# Altium project PoE_Base.PrjPcb
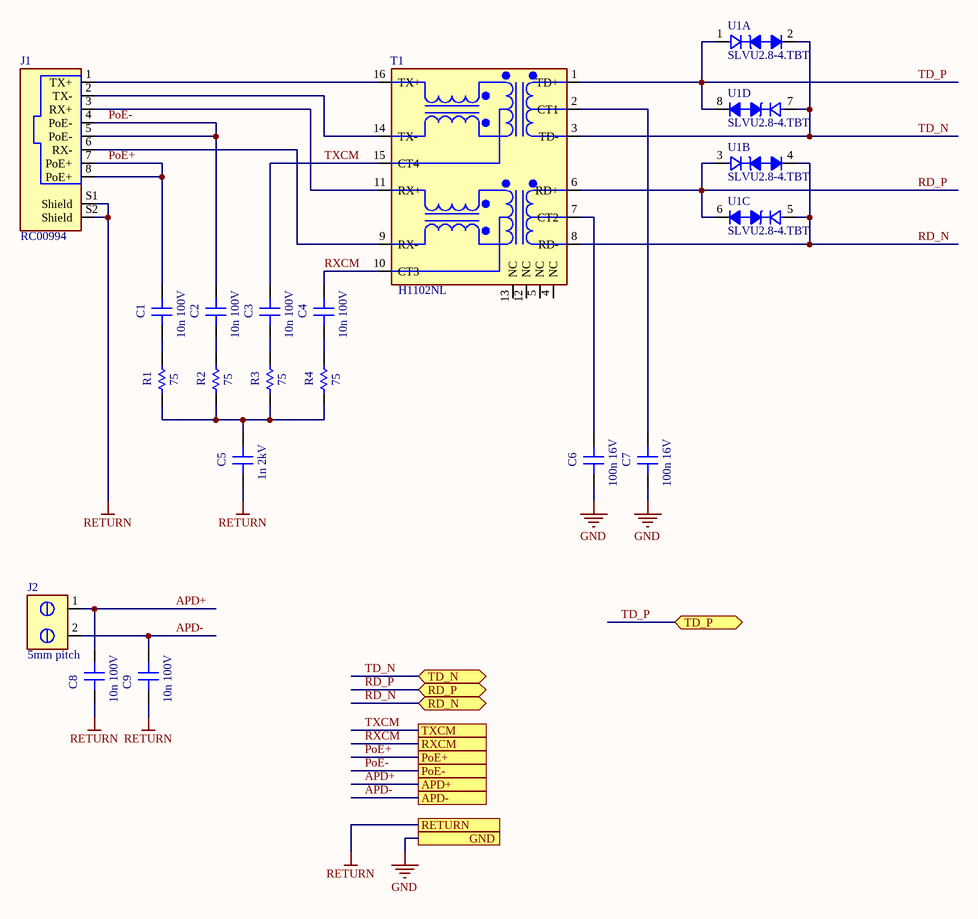
[diagram p0: Sch_Input.SchDoc]
documentnumber: 1; Engineer1: Renan Duarte; Engineer2: André P.; Engineer3: Guilherme B.; Engineer4: Rafael B.; revision: 0; title: PoE Base Board
5 sheets, 106 parts. Net scope: flat (ports and power ports of the same name join across sheets).
Board file: PCB_Base.PcbDoc
Sheets:
  Sch_Input.SchDoc
  Sch_Power.SchDoc
  Sch_Phy.SchDoc
  Sch_Buck.SchDoc
  Sch_Control.SchDoc

## Sheet Sch_Input.SchDoc: PoE Base Board
size A4; ENG_APP_DATE: --/--/--; DSN_APP_DATE: --/--/--; CHK_APP_DATE: --/--/--; CompanyName: Universidade Federal de Santa Maria; Organization: Universidade Federal de Santa Maria; Address1: Av. Roraima 1000; Address2: Camobi; Address3: Santa Maria - RS; Address4: Brasil; SheetNumber: 2; SheetTotal: 6

### Parts
(Parts that share a designator on the sheet are numbered #1, #2 ... from top to bottom, then left to right.)
C1#1  10n 100V  [CAP_SMD_0603]
C2#1  10n 100V  [CAP_SMD_0603]
C3#1  10n 100V  [CAP_SMD_0603]
C4#1  10n 100V  [CAP_SMD_0603]
C5#1  1n 2kV  [CAP_SMD_1206]
C6  100n 16V  [CAP_SMD_0603]
C7  100n 16V  [CAP_SMD_0603]
C8  10n 100V  [CAP_SMD_0603]
C9  10n 100V  [CAP_SMD_0603]
J1#1  RC00994  [CON_PTH_RJ45_RC00994]
J2  5mm pitch  [CON_SCREW_5mm]
R1#1  75  [RES_SMD_0603]
R2  75  [RES_SMD_0603]
R3  75  [RES_SMD_0603]
R4  75  [RES_SMD_0603]
T1  H1102NL  [T_SMD_H1102NL]
U1#1  SLVU2.8-4.TBT  [IC_SOIC8]  (parts A,B,C,D of 4)

### Ports
APD+, APD-, GND, PoE+, PoE-, RD_N (bidir), RD_P (bidir), RETURN, RXCM, TD_N (bidir), TD_P (bidir), TXCM

### Nets
APD-: C6.2 C7.2 C9.1 J2.2 ; port APD-, port GND  [also labelled GND]
RETURN: C5#1.2 C8.2 C9.2 J1#1.S1(Shield) J1#1.S2(Shield) ; port RETURN
APD+: C8.1 J2.1 ; port APD+
PoE+: C1#1.1 J1#1.7(PoE+) J1#1.8(PoE+) ; port PoE+
PoE-: C2#1.1 J1#1.4(PoE-) J1#1.5(PoE-) ; port PoE-
RD_N: T1.8(RD-) U1#1.4 U1#1.5 ; port RD_N
RD_P: T1.6(RD+) U1#1.3 U1#1.6 ; port RD_P
RXCM: C4#1.1 T1.10(CT3) ; port RXCM
TD_N: T1.3(TD-) U1#1.2 U1#1.7 ; port TD_N
TD_P: T1.1(TD+) U1#1.1 U1#1.8 ; port TD_P
TXCM: C3#1.1 T1.15(CT4) ; port TXCM
NetC1#1_2: C1#1.2 R1#1.1
NetC2#1_2: C2#1.2 R2.1
NetC3#1_2: C3#1.2 R3.1
NetC4#1_2: C4#1.2 R4.1
NetC5#1_1: C5#1.1 R1#1.2 R2.2 R3.2 R4.2
NetC6_1: C6.1 T1.7(CT2)
NetC7_1: C7.1 T1.2(CT1)
NetJ1#1_1: J1#1.1(TX+) T1.16(TX+)
NetJ1#1_2: J1#1.2(TX-) T1.14(TX-)
NetJ1#1_3: J1#1.3(RX+) T1.11(RX+)
NetJ1#1_6: J1#1.6(RX-) T1.9(RX-)

Not connected (* = marked no-connect by the designer): T1 4(NC) 5(NC) 12(NC) 13(NC)

### Notes on the sheet
- Engineers
- Title
- Size:
- Date:
- A4
- Number:
- Time:
- Revision:
- Sheet
- of
- File:

### Library data of the parts
C1#1 C2#1 C3#1 C4#1 C5#1 C6-C9 = CAP_SMD: Capacitor SMD - Generic
J1#1 = CON_PTH_RJ45_RC00994: RC00994 RJ45 connector - No LEDs
J2 = CON_SCREW-2P-5mm: 5mm pitch 2P screw terminal block
R1#1 R2-R4 = RES_SMD: Resistor SMD - Generic
T1 = H1102NL: Isolation and Data Interface (Encapsulated) Pulse Transformer 1:1 Transmitter, 1:1 Receiver Surface Mount; SnapEDA_Link: https://www.snapeda.com/parts/H1102NL/Pulse/view-part/?ref=snap; Package: Non Standard Pulse; Value: *; MF: Pulse; MP: H1102NL; Check_prices: https://www.snapeda.com/parts/H1102NL/Pulse/view-part/?ref=eda
U1#1 = IC_SLVU2.8-4.TBT: 15V Clamp 24A (8/20µs) Ipp Tvs Diode Surface Mount 8-SO; MF: Semtech Corporation; SnapEDA_Link: https://www.snapeda.com/parts/SLVU2.8-4.TBT/Semtech/view-part/?ref=snap; Package: SOIC-8 Semtech; Value: *; MP: SLVU2.8-4.TBT; Check_prices: https://www.snapeda.com/parts/SLVU2.8-4.TBT/Semtech/view-part/?ref=eda

## Sheet Sch_Power.SchDoc: PoE Base Board
size A4; ENG_APP_DATE: --/--/--; DSN_APP_DATE: --/--/--; CHK_APP_DATE: --/--/--; CompanyName: Universidade Federal de Santa Maria; Organization: Universidade Federal de Santa Maria; Address1: Av. Roraima 1000; Address2: Camobi; Address3: Santa Maria - RS; Address4: Brasil; SheetNumber: 3; SheetTotal: 6
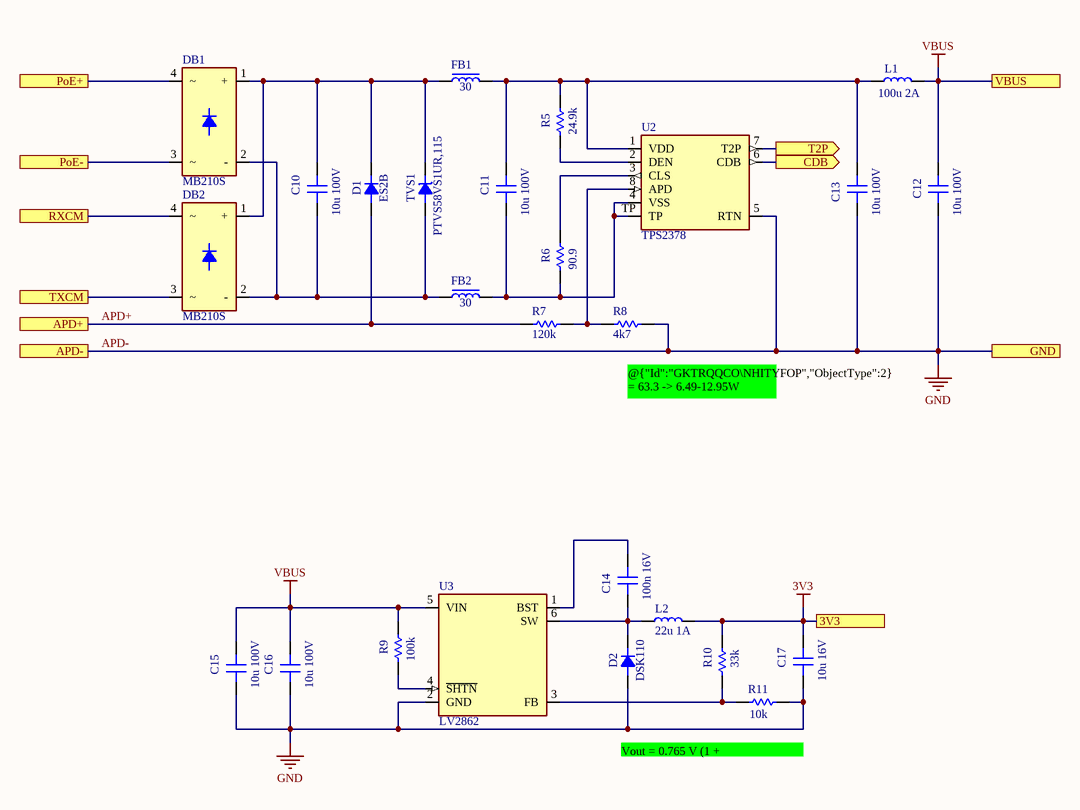
[diagram p1: Sch_Power.SchDoc]

### Parts
C10  10u 100V  [CAP_SMD_1210]
C11  10u 100V  [CAP_SMD_1210]
C12  10u 100V  [CAP_SMD_1210]
C13  10u 100V  [CAP_SMD_1210]
C14  100n 16V  [CAP_SMD_0603]
C15  10u 100V  [CAP_SMD_1210]
C16  10u 100V  [CAP_SMD_1210]
C17  10u 16V  [CAP_SMD_1210]
D1  ES2B  [D_SMA]
D2  DSK110  [D_SMD_SOD123W]
DB1  MB210S  [IC_MBS]
DB2  MB210S  [IC_MBS]
FB1  30  [FB_SMD_0805]
FB2  30  [FB_SMD_0805]
L1  100u 2A  [IND_SMD7.1x6.6x5]
L2  22u 1A  [IND_SMD3x3x1.2mm]
R5  24.9k  [RES_SMD_0603]
R6  90.9  [RES_SMD_0603]
R7  120k  [RES_SMD_0603]
R8  4k7  [RES_SMD_0603]
R9  100k  [RES_SMD_0603]
R10  33k  [RES_SMD_0603]
R11  10k  [RES_SMD_0603]
TVS1  PTVS58VS1UR,115  [D_SOD123W]
U2  TPS2378  [IC_SOIC8_TP]
U3  LV2862  [IC_SOT23_6]

### Ports
3V3, APD+, APD-, CDB (out), GND, PoE+, PoE-, RXCM, T2P (out), TXCM, VBUS

### Nets
3V3: C17.1 L2.2 R10.1 ; port 3V3
APD-: C12.2 C13.2 C15.2 C16.2 C17.2 D2.A R8.2 R11.2 U2.5(RTN) U3.2(GND) ; port APD-, port GND  [also labelled GND]
VBUS: C12.1 C15.1 C16.1 L1.2 R9.1 U3.5(VIN) ; port VBUS
APD+: D1.A R7.1 ; port APD+
CDB: U2.6(CDB) ; port CDB
PoE+: DB1.4 ; port PoE+
PoE-: DB1.3 ; port PoE-
RXCM: DB2.4 ; port RXCM
T2P: U2.7(T2P) ; port T2P
TXCM: DB2.3 ; port TXCM
NetC10_1: C10.1 D1.K DB1.1(+) DB2.1(+) FB1.1 TVS1.K
NetC10_2: C10.2 DB1.2(-) DB2.2(-) FB2.1 TVS1.A
NetC11_1: C11.1 C13.1 FB1.2 L1.1 R5.1 U2.1(VDD)
NetC11_2: C11.2 FB2.2 R6.2 U2.4(VSS) U2.TP
NetC14_1: C14.1 U3.1(BST)
NetC14_2: C14.2 D2.K L2.1 U3.6(SW)
NetR5_2: R5.2 U2.2(DEN)
NetR6_1: R6.1 U2.3(CLS)
NetR7_2: R7.2 R8.1 U2.8(APD)
NetR9_2: R9.2 U3.4(~{SHTN})
NetR10_2: R10.2 R11.1 U3.3(FB)

### Notes on the sheet
- (near R8) @{"Id":"GKTRQQCO\NHITYFOP","ObjectType":2} = 63.3 -> 6.49-12.95W
  @{"Id":"GKTRQQCO\NHITYFOP","ObjectType":2} = 90.9 -> 12.95-25.5W
- (near R11) Vout = 0.765 V (1 + (@{"Id":"GKTRQQCO\DMOJSVDS","ObjectType":2} / @{"Id":"GKTRQQCO\RENRJCZA","ObjectType":2}))
- Engineers
- Title
- Size:
- Date:
- A4
- Number:
- Time:
- Revision:
- Sheet
- of
- File:

### Library data of the parts
C10-C17 = CAP_SMD: Capacitor SMD - Generic
D1 = ES1J: 100V 2A Super Fast Recovery Rectifier; Datasheet: https://www.onsemi.com/download/data-sheet/pdf/es1j-d.pdf
D2 = DIODE_SMD: 100V 1A Schottky Barrier Diode
DB1 DB2 = MB2S: 100 2A diode bridge; MF: Fortune Semiconductor; MP: DW01A; SnapEDA_Link: https://www.snapeda.com/parts/DW01A/Fortune+Semiconductor/view-part/?ref=snap; Package: SOT-23-6 Fortune Semiconductor; Value: *; Check_prices: https://www.snapeda.com/parts/DW01A/Fortune+Semiconductor/view-part/?ref=eda
FB1 FB2 = FB_SMD: Ferrite bead SMD - Generic
L1 L2 = IND_SMD: Inductor SMD - Generic
R5-R11 = RES_SMD: Resistor SMD - Generic
TVS1 = ZENER_SMD: SMD zener diode - Generic
U2 = TPS2378: IEEE 802.3at PoE High-Power PD Interface; MF: Fortune Semiconductor; MP: DW01A; SnapEDA_Link: https://www.snapeda.com/parts/DW01A/Fortune+Semiconductor/view-part/?ref=snap; Package: SOT-23-6 Fortune Semiconductor; Value: *; Check_prices: https://www.snapeda.com/parts/DW01A/Fortune+Semiconductor/view-part/?ref=eda
U3 = LV2862: Buck converter controller; Datasheet: https://www.littelfuse.com/assetdocs/littelfuse-integrated-circuits-mxhv9910-datasheet?assetguid=0135616d-093f-45d8-8766-b0e533f2ef99

## Sheet Sch_Phy.SchDoc: PoE Base Board
size A4; ENG_APP_DATE: --/--/--; DSN_APP_DATE: --/--/--; CHK_APP_DATE: --/--/--; CompanyName: Universidade Federal de Santa Maria; Organization: Universidade Federal de Santa Maria; Address1: Av. Roraima 1000; Address2: Camobi; Address3: Santa Maria - RS; Address4: Brasil; SheetNumber: 4; SheetTotal: 6
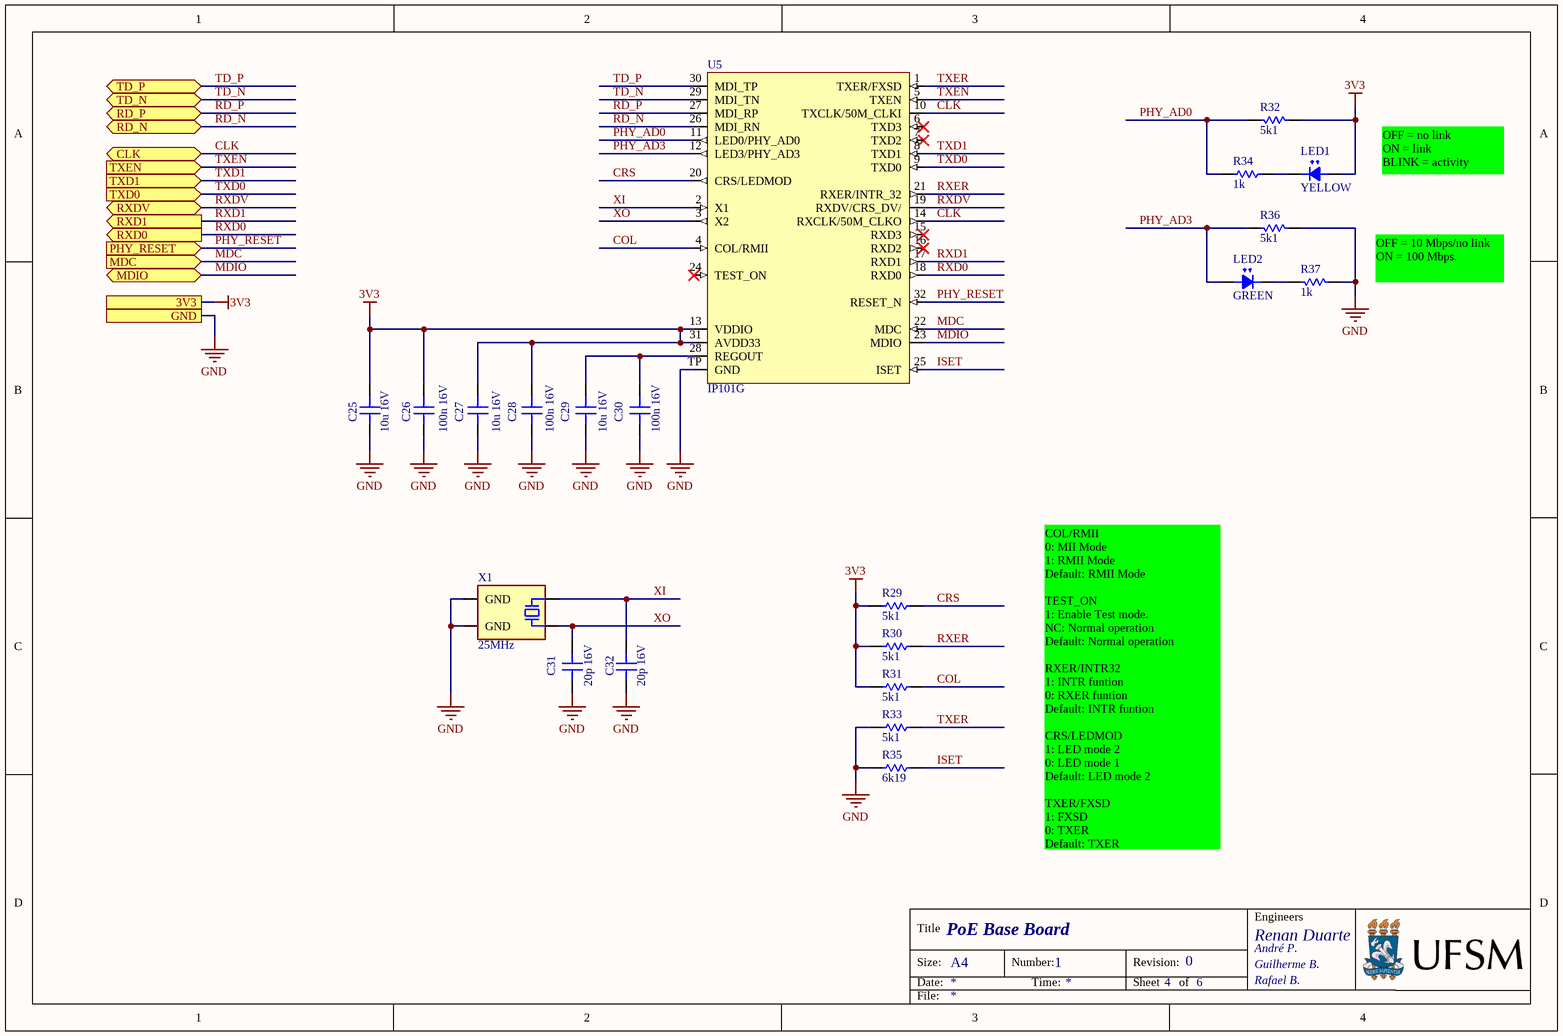
[diagram p2: Sch_Phy.SchDoc]

### Parts
C25  10u 16V  [CAP_SMD_0603]
C26  100n 16V  [CAP_SMD_0603]
C27  10u 16V  [CAP_SMD_0603]
C28  100n 16V  [CAP_SMD_0603]
C29  10u 16V  [CAP_SMD_0603]
C30  100n 16V  [CAP_SMD_0603]
C31  20p 16V  [CAP_SMD_0603]
C32  20p 16V  [CAP_SMD_0603]
LED1  YELLOW  [LED_SMD_0603]
LED2  GREEN  [LED_SMD_0603]
R29  5k1  [RES_SMD_0603]
R30  5k1  [RES_SMD_0603]
R31  5k1  [RES_SMD_0603]
R32  5k1  [RES_SMD_0603]
R33  5k1  [RES_SMD_0603]
R34  1k  [RES_SMD_0603]
R35  6k19  [RES_SMD_0603]
R36  5k1  [RES_SMD_0603]
R37  1k  [RES_SMD_0603]
U5  IP101G  [IC_QFN32_4x4]
X1  25MHz  [XTAL_SMD_3525]

### Ports
3V3, CLK (bidir), GND, MDC (in), MDIO (bidir), PHY_RESET (in), RD_N (bidir), RD_P (bidir), RXD0 (out), RXD1 (out), RXDV (bidir), TD_N (bidir), TD_P (bidir), TXD0 (in), TXD1 (in), TXEN (in)

### Nets
3V3: C25.1 C26.1 C27.1 C28.1 LED1.A R29.2 R30.2 R31.2 R32.2 U5.13(VDDIO) U5.31(AVDD33) ; port 3V3
GND: C25.2 C26.2 C27.2 C28.2 C29.2 C30.2 C31.2 C32.2 R33.2 R35.2 R36.2 R37.2 U5.TP(GND) X1.2(GND) X1.4(GND) ; port GND  [project net APD-]
CLK: U5.10(TXCLK/50M_CLKI) U5.14(RXCLK/50M_CLKO) ; port CLK
COL: R31.1 U5.4(COL/RMII)
CRS: R29.1 U5.20(CRS/LEDMOD)
ISET: R35.1 U5.25(ISET)
MDC: U5.22(MDC) ; port MDC
MDIO: U5.23(MDIO) ; port MDIO
PHY_AD0: R32.1 R34.2 U5.11(LED0/PHY_AD0)
PHY_AD3: LED2.A R36.1 U5.12(LED3/PHY_AD3)
PHY_RESET: U5.32(RESET_N) ; port PHY_RESET
RD_N: U5.26(MDI_RN) ; port RD_N
RD_P: U5.27(MDI_RP) ; port RD_P
RXD0: U5.18(RXD0) ; port RXD0
RXD1: U5.17(RXD1) ; port RXD1
RXDV: U5.19(RXDV/CRS_DV/) ; port RXDV
RXER: R30.1 U5.21(RXER/INTR_32)
TD_N: U5.29(MDI_TN) ; port TD_N
TD_P: U5.30(MDI_TP) ; port TD_P
TXD0: U5.9(TXD0) ; port TXD0
TXD1: U5.8(TXD1) ; port TXD1
TXEN: U5.5(TXEN) ; port TXEN
TXER: R33.1 U5.1(TXER/FXSD)
XI: C32.1 U5.2(X1) X1.3
XO: C31.1 U5.3(X2) X1.1
NetC29_1: C29.1 C30.1 U5.28(REGOUT)
NetLED1_K: LED1.K R34.1
NetLED2_K: LED2.K R37.1

Not connected (* = marked no-connect by the designer): U5 6(TXD3)* 7(TXD2)* 15(RXD3)* 16(RXD2)* 24(TEST_ON)*

### Notes on the sheet
- OFF = no link
  ON = link
  BLINK = activity
- (near R37) OFF = 10 Mbps/no link
  ON = 100 Mbps.
- COL/RMII
  0: MII Mode
  1: RMII Mode
  Default: RMII Mode
  TEST_ON
  1: Enable Test mode.
  NC: Normal operation
  Default: Normal operation
  RXER/INTR32
  1: INTR funtion
  0: RXER funtion
  Default: INTR funtion
  CRS/LEDMOD
  1: LED mode 2
  0: LED mode 1
  Default: LED mode 2
  TXER/FXSD
  1: FXSD
  0: TXER
  Default: TXER
- Engineers
- Title
- Size:
- Date:
- A4
- Number:
- Time:
- Revision:
- Sheet
- of
- File:

### Library data of the parts
C25-C32 = CAP_SMD: Capacitor SMD - Generic
LED1 LED2 = LED_SMD: LED SMD - Generic
R29-R37 = RES_SMD: Resistor SMD - Generic
U5 = IC_IP101G: Single Port 10/100 MII/RMII/TP/Fiber Fast Ethernet Transceiver
X1 = XTAL_SMD_GND: SMD Crystal with GND - Generic

## Sheet Sch_Buck.SchDoc: PoE Base Board
size A4; ENG_APP_DATE: --/--/--; DSN_APP_DATE: --/--/--; CHK_APP_DATE: --/--/--; CompanyName: Universidade Federal de Santa Maria; Organization: Universidade Federal de Santa Maria; Address1: Av. Roraima 1000; Address2: Camobi; Address3: Santa Maria - RS; Address4: Brasil; SheetNumber: 5; SheetTotal: 6
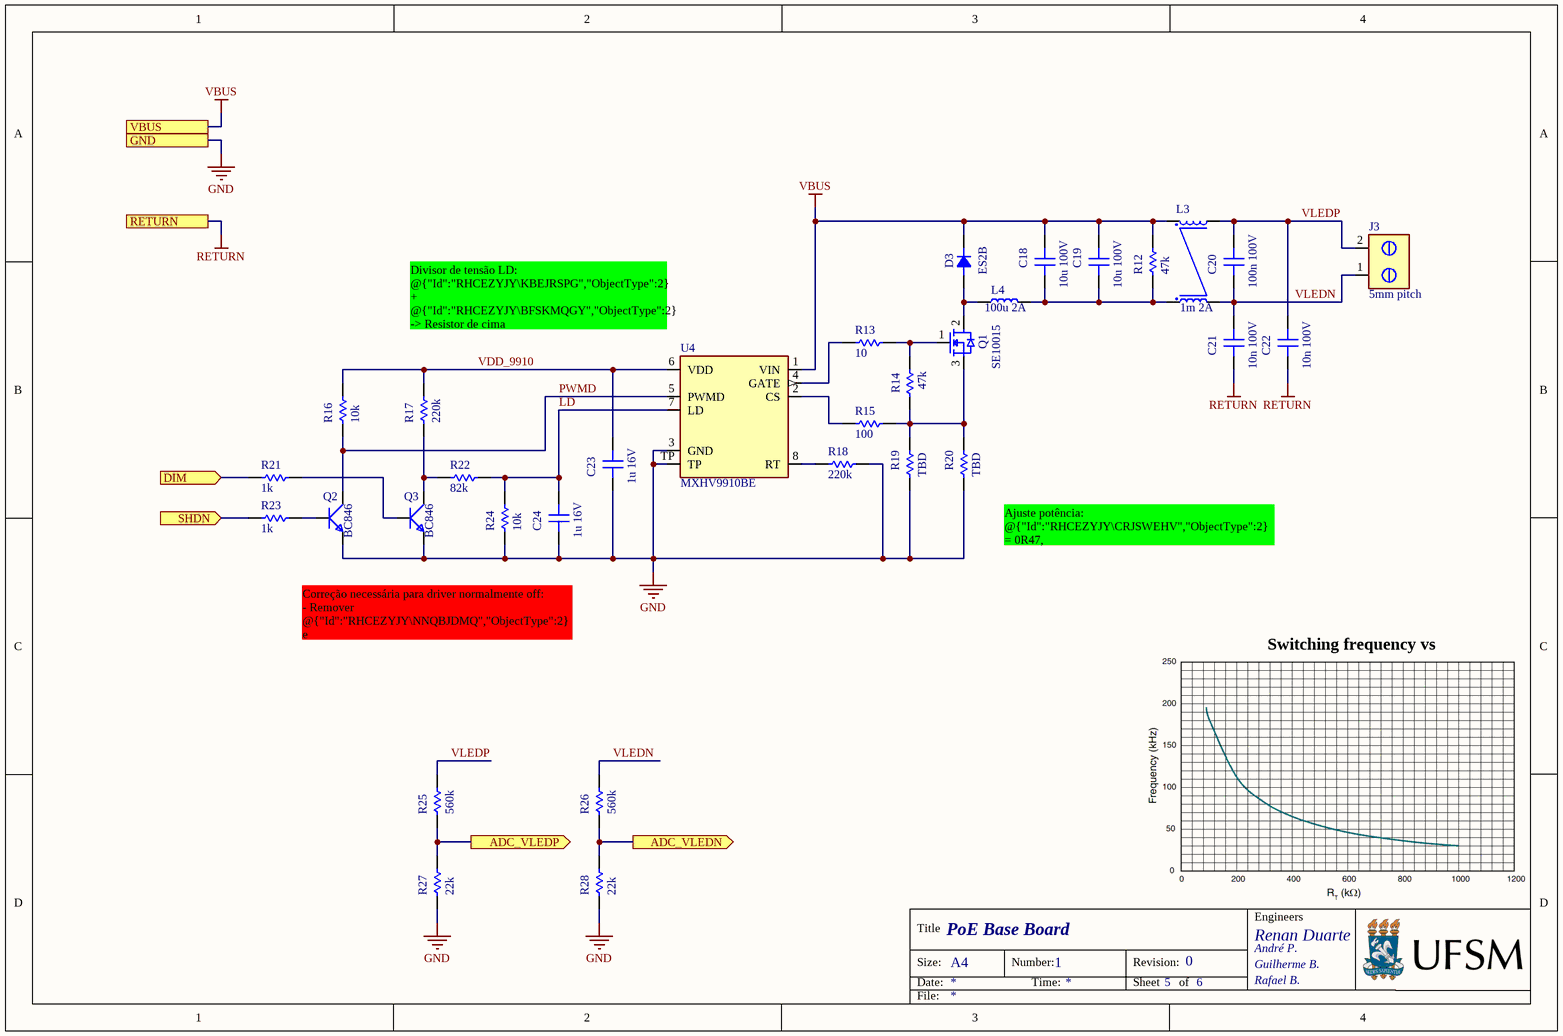
[diagram p3: Sch_Buck.SchDoc]

### Parts
C18  10u 100V  [CAP_SMD_1210]
C19  10u 100V  [CAP_SMD_1210]
C20  100n 100V  [CAP_SMD_1206]
C21  10n 100V  [CAP_SMD_0603]
C22  10n 100V  [CAP_SMD_0603]
C23  1u 16V  [CAP_SMD_0603]
C24  1u 16V  [CAP_SMD_0603]
D3  ES2B  [D_SMA]
J3  5mm pitch  [CON_SCREW_5mm]
L3  1m 2A  [IND_CM_PTH_10x6x5]
L4  100u 2A  [IND_SMD7.1x6.6x5]
Q1  SE10015  [IC_TO252]
Q2  BC846  [IC_SOT23]
Q3  BC846  [IC_SOT23]
R12  47k  [RES_SMD_1206]
R13  10  [RES_SMD_0603]
R14  47k  [RES_SMD_0603]
R15  100  [RES_SMD_0603]
R16  10k  [RES_SMD_0603]
R17  220k  [RES_SMD_0603]
R18  220k  [RES_SMD_0603]
R19  TBD  [RES_SMD_1206]
R20  TBD  [RES_SMD_1206]
R21  1k  [RES_SMD_0603]
R22  82k  [RES_SMD_0603]
R23  1k  [RES_SMD_0603]
R24  10k  [RES_SMD_0603]
R25  560k  [RES_SMD_0603]
R26  560k  [RES_SMD_0603]
R27  22k  [RES_SMD_0603]
R28  22k  [RES_SMD_0603]
U4  MXHV9910BE  [IC_SOIC8_TP]

### Ports
ADC_VLEDN (out), ADC_VLEDP (out), DIM (in), GND, RETURN, SHDN (in), VBUS

### Nets
GND: C23.2 C24.2 Q2.2(E) Q3.2(E) R18.1 R19.2 R20.2 R24.2 R27.2 R28.2 U4.3(GND) U4.TP ; port GND  [project net APD-]
RETURN: C21.2 C22.2 ; port RETURN
VBUS: C18.1 C19.1 D3.K L3.3 R12.1 U4.1(VIN) ; port VBUS
ADC_VLEDN: R26.2 R28.1 ; port ADC_VLEDN
ADC_VLEDP: R25.2 R27.1 ; port ADC_VLEDP
DIM: R21.2 ; port DIM
LD: C24.1 R22.2 R24.1 U4.7(LD)
PWMD: Q2.3(C) R16.2 U4.5(PWMD)
SHDN: R23.2 ; port SHDN
VDD_9910: C23.1 R16.1 R17.1 U4.6(VDD)
VLEDN: C20.2 C21.1 J3.1 L3.2 R26.1
VLEDP: C20.1 C22.1 J3.2 L3.4 R25.1
NetC18_2: C18.2 C19.2 L3.1 L4.2 R12.2
NetD3_A: D3.A L4.1 Q1.2(D1)
NetQ1_1: Q1.1(G1) R13.2 R14.2
NetQ1_3: Q1.3(S1) R14.1 R15.2 R19.1 R20.1
NetQ2_1: Q2.1(B) R23.1
NetQ3_1: Q3.1(B) R21.1
NetQ3_3: Q3.3(C) R17.2 R22.1
NetR13_1: R13.1 U4.4(GATE)
NetR15_1: R15.1 U4.2(CS)
NetR18_2: R18.2 U4.8(RT)

### Notes on the sheet
- Divisor de tensão LD:
  @{"Id":"RHCEZYJY\KBEJRSPG","ObjectType":2} + @{"Id":"RHCEZYJY\BFSKMQGY","ObjectType":2} -> Resistor de cima
  @{"Id":"RHCEZYJY\OUCGEZBT","ObjectType":2} -> Resistor de baixo
  VDD_9910 = 7.8V. Saída 250mV com DIM 100%
- (near R20) Ajuste potência:
  @{"Id":"RHCEZYJY\CRJSWEHV","ObjectType":2} = 0R47, @{"Id":"RHCEZYJY\AXEUKIXJ","ObjectType":2} = 1R0 ->12.95W @VLED 36V
  @{"Id":"RHCEZYJY\CRJSWEHV","ObjectType":2} = 0R22, @{"Id":"RHCEZYJY\AXEUKIXJ","ObjectType":2} = 1R0 ->25.5W @VLED 36V
- Correção necessária para driver normalmente off:
  - Remover @{"Id":"RHCEZYJY\NNQBJDMQ","ObjectType":2} e @{"Id":"RHCEZYJY\GAUXEEJQ","ObjectType":2}
  - Ligar 10k entre C e E de @{"Id":"RHCEZYJY\GAUXEEJQ","ObjectType":2}
  - Ligar 0R entre @{"Id":"RHCEZYJY\NOSETIQT","ObjectType":2} e @{"Id":"RHCEZYJY\EUNIWYSG","ObjectType":1}
- Switching frequency vs @{"Id":"RHCEZYJY\QCLCCCMT","ObjectType":2} value
- Engineers
- Title
- Size:
- Date:
- A4
- Number:
- Time:
- Revision:
- Sheet
- of
- File:

### Library data of the parts
C18-C24 = CAP_SMD: Capacitor SMD - Generic
D3 = ES1J: 100V 2A Super Fast Recovery Rectifier; Datasheet: https://www.onsemi.com/download/data-sheet/pdf/es1j-d.pdf
J3 = CON_SCREW-2P-5mm: 5mm pitch 2P screw terminal block
L3 = IND_CM_PTH: Common mode inductor PTH- Generic
L4 = IND_SMD: Inductor SMD - Generic
Q1 = MOSFET_SMD: 100V 15A 80mOhm N MOSFET
Q2 Q3 = TRAN_SMD_NPN: SMD transistor NPN - Generic
R12-R28 = RES_SMD: Resistor SMD - Generic
U4 = MXHV9910BE: Off-Line, High Brightness LED Driver; Datasheet: https://www.littelfuse.com/assetdocs/littelfuse-integrated-circuits-mxhv9910-datasheet?assetguid=0135616d-093f-45d8-8766-b0e533f2ef99

## Sheet Sch_Control.SchDoc: PoE Base Board
size A4; Organization: ORGANIZATION; Address1: ADDRESS 1; Address2: ADDRESS 2; Address3: ADDRESS 3; Address4: ADDRESS 4; Revision: 1; SheetNumber: 1; SheetTotal: 1; ENG_APP_DATE: --/--/--; DSN_APP_DATE: --/--/--; CHK_APP_DATE: --/--/--; Engineer1: Renan Duarte
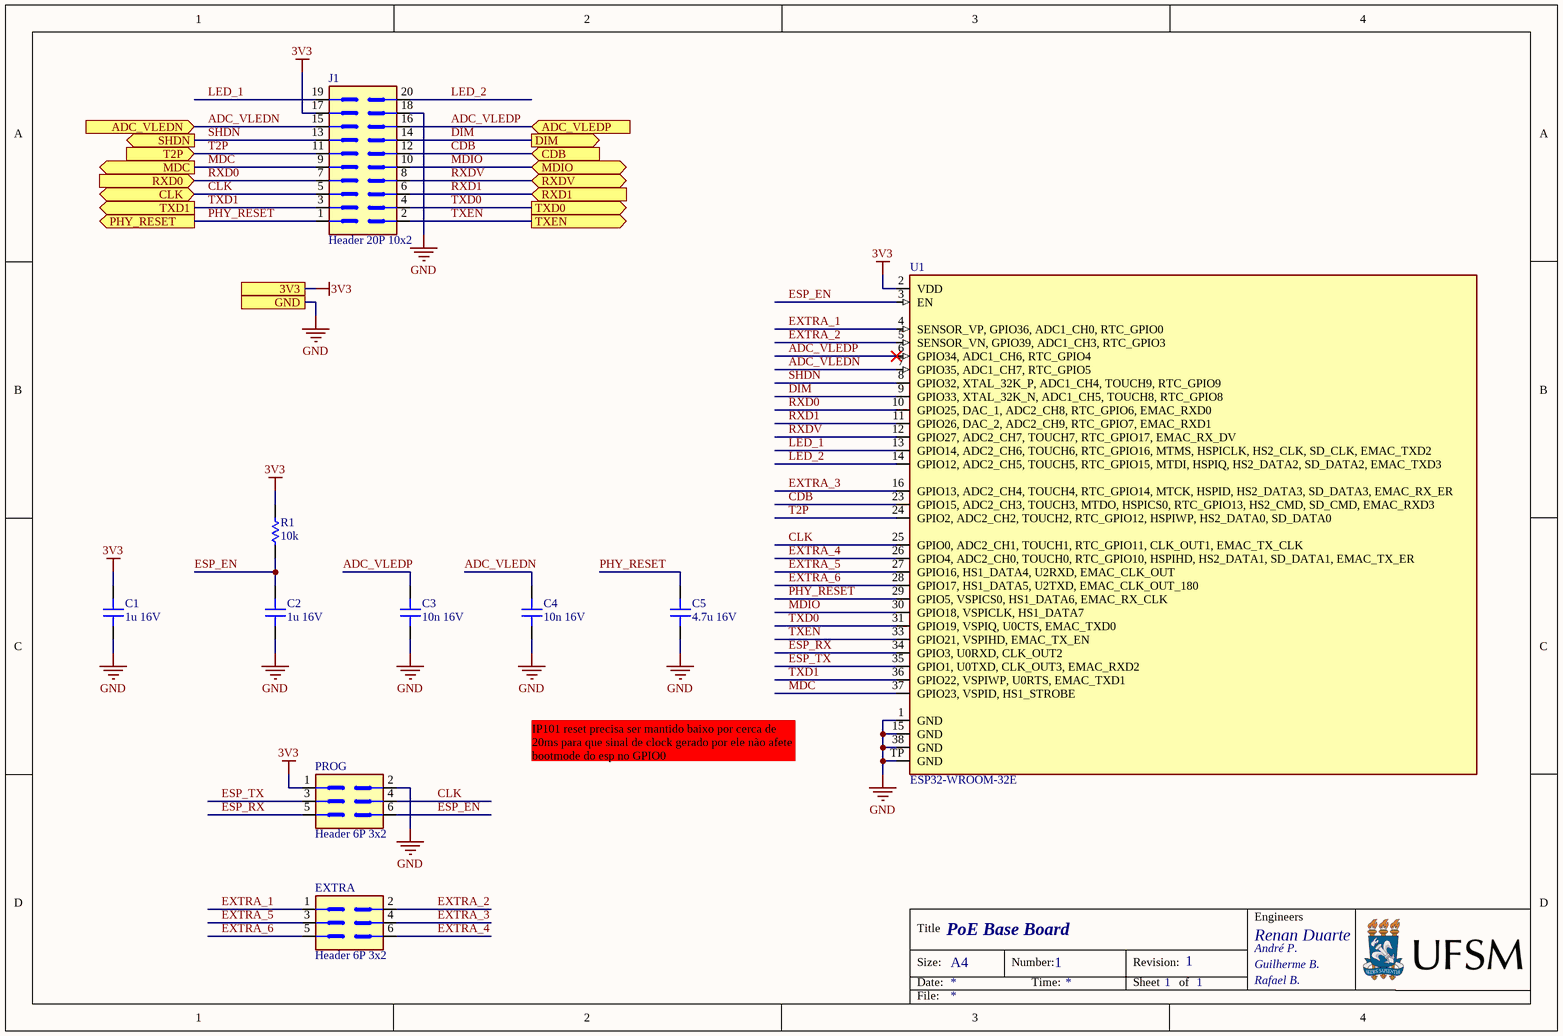
[diagram p4: Sch_Control.SchDoc]

### Parts
(Parts that share a designator on the sheet are numbered #1, #2 ... from top to bottom, then left to right.)
C1#2  1u 16V  [CAP_SMD_0603]
C2#2  1u 16V  [CAP_SMD_0603]
C3#2  10n 16V  [CAP_SMD_0603]
C4#2  10n 16V  [CAP_SMD_0603]
C5#2  4.7u 16V  [CAP_SMD_0603]
EXTRA  Header 6P 3x2  [CON_PTH_6P_HEADER_3x2_2.54mm]  (no BOM)
J1#2  Header 20P 10x2  [CON_PTH_20P_HEADER_10x2_2.54mm]
PROG  Header 6P 3x2  [CON_PTH_6P_HEADER_3x2_2.54mm]  (no BOM)
R1#2  10k  [RES_SMD_0603]
U1#2  ESP32-WROOM-32E  [IC_ESP32-WROOM-32UE-H4]

### Ports
3V3, ADC_VLEDN (in), ADC_VLEDP (in), CDB (in), CLK (bidir), DIM (out), GND, MDC (out), MDIO (bidir), PHY_RESET (out), RXD0 (in), RXD1 (in), RXDV (bidir), SHDN (out), T2P (in), TXD0 (out), TXD1 (out), TXEN (out)

### Nets
3V3: C1#2.1 J1#2.17 PROG.1 R1#2.1 U1#2.2(VDD) ; port 3V3
GND: C1#2.2 C2#2.2 C3#2.2 C4#2.2 C5#2.2 J1#2.18 PROG.2 U1#2.1(GND) U1#2.15(GND) U1#2.38(GND) U1#2.TP(GND) ; port GND  [project net APD-]
ADC_VLEDN: C4#2.1 J1#2.15 U1#2.7(GPIO35,_ADC1_CH7,_RTC_GPIO5) ; port ADC_VLEDN
ADC_VLEDP: C3#2.1 J1#2.16 U1#2.6(GPIO34,_ADC1_CH6,_RTC_GPIO4) ; port ADC_VLEDP
CDB: J1#2.12 U1#2.23(GPIO15,_ADC2_CH3,_TOUCH3,_MTDO,_HSPICS0,_RTC_GPIO13,_HS2_CMD,_SD_CMD,_EMAC_RXD3) ; port CDB
CLK: J1#2.5 PROG.4 U1#2.25(GPIO0,_ADC2_CH1,_TOUCH1,_RTC_GPIO11,_CLK_OUT1,_EMAC_TX_CLK) ; port CLK
DIM: J1#2.14 U1#2.9(GPIO33,_XTAL_32K_N,_ADC1_CH5,_TOUCH8,_RTC_GPIO8) ; port DIM
ESP_EN: C2#2.1 PROG.6 R1#2.2 U1#2.3(EN)
ESP_RX: PROG.5 U1#2.34(GPIO3,_U0RXD,_CLK_OUT2)
ESP_TX: PROG.3 U1#2.35(GPIO1,_U0TXD,_CLK_OUT3,_EMAC_RXD2)
EXTRA_1: EXTRA.1 U1#2.4(SENSOR_VP,_GPIO36,_ADC1_CH0,_RTC_GPIO0)
EXTRA_2: EXTRA.2 U1#2.5(SENSOR_VN,_GPIO39,_ADC1_CH3,_RTC_GPIO3)
EXTRA_3: EXTRA.4 U1#2.16(GPIO13,_ADC2_CH4,_TOUCH4,_RTC_GPIO14,_MTCK,_HSPID,_HS2_DATA3,_SD_DATA3,_EMAC_RX_ER)
EXTRA_4: EXTRA.6 U1#2.26(GPIO4,_ADC2_CH0,_TOUCH0,_RTC_GPIO10,_HSPIHD,_HS2_DATA1,_SD_DATA1,_EMAC_TX_ER)
EXTRA_5: EXTRA.3 U1#2.27(GPIO16,_HS1_DATA4,_U2RXD,_EMAC_CLK_OUT)
EXTRA_6: EXTRA.5 U1#2.28(GPIO17,_HS1_DATA5,_U2TXD,_EMAC_CLK_OUT_180)
LED_1: J1#2.19 U1#2.13(GPIO14,_ADC2_CH6,_TOUCH6,_RTC_GPIO16,_MTMS,_HSPICLK,_HS2_CLK,_SD_CLK,_EMAC_TXD2)
LED_2: J1#2.20 U1#2.14(GPIO12,_ADC2_CH5,_TOUCH5,_RTC_GPIO15,_MTDI,_HSPIQ,_HS2_DATA2,_SD_DATA2,_EMAC_TXD3)
MDC: J1#2.9 U1#2.37(GPIO23,_VSPID,_HS1_STROBE) ; port MDC
MDIO: J1#2.10 U1#2.30(GPIO18,_VSPICLK,_HS1_DATA7) ; port MDIO
PHY_RESET: C5#2.1 J1#2.1 U1#2.29(GPIO5,_VSPICS0,_HS1_DATA6,_EMAC_RX_CLK) ; port PHY_RESET
RXD0: J1#2.7 U1#2.10(GPIO25,_DAC_1,_ADC2_CH8,_RTC_GPIO6,_EMAC_RXD0) ; port RXD0
RXD1: J1#2.6 U1#2.11(GPIO26,_DAC_2,_ADC2_CH9,_RTC_GPIO7,_EMAC_RXD1) ; port RXD1
RXDV: J1#2.8 U1#2.12(GPIO27,_ADC2_CH7,_TOUCH7,_RTC_GPIO17,_EMAC_RX_DV) ; port RXDV
SHDN: J1#2.13 U1#2.8(GPIO32,_XTAL_32K_P,_ADC1_CH4,_TOUCH9,_RTC_GPIO9) ; port SHDN
T2P: J1#2.11 U1#2.24(GPIO2,_ADC2_CH2,_TOUCH2,_RTC_GPIO12,_HSPIWP,_HS2_DATA0,_SD_DATA0) ; port T2P
TXD0: J1#2.4 U1#2.31(GPIO19,_VSPIQ,_U0CTS,_EMAC_TXD0) ; port TXD0
TXD1: J1#2.3 U1#2.36(GPIO22,_VSPIWP,_U0RTS,_EMAC_TXD1) ; port TXD1
TXEN: J1#2.2 U1#2.33(GPIO21,_VSPIHD,_EMAC_TX_EN) ; port TXEN

### Notes on the sheet
- IP101 reset precisa ser mantido baixo por cerca de 20ms para que sinal de clock gerado por ele não afete bootmode do esp no GPIO0
- Engineers
- Title
- Size:
- Date:
- A4
- Number:
- Time:
- Revision:
- Sheet
- of
- File:

### Library data of the parts
C1#2 C2#2 C3#2 C4#2 C5#2 = CAP_SMD: Capacitor SMD - Generic
EXTRA PROG = CON_PTH_HEADER_6P_3x2: 3x2 6P PTH pin header - Generic
J1#2 = CON_PTH_HEADER_20P_10x2: 10x2 20P PTH pin header - Generic
R1#2 = RES_SMD: Resistor SMD - Generic
U1#2 = MODULE_ESP32-WROOM-32E: RX TXRX MOD WIFI TRACE ANT SMD; MF: Espressif Systems; Package: SMD-44 Espressif Systems; Value: *; MP: ESP32-WROOM-32E; Datasheet: https://datasheet.octopart.com/ESP32-WROOM-32E-%284MB%29-Espressif-Systems-datasheet-151884363.pd

## Nets that join several sheets
3V3: Sch_Power (C17.1 L2.2 R10.1), Sch_Phy (11 pins), Sch_Control (5 pins)
APD-: Sch_Input (C6.2 C7.2 C9.1 J2.2), Sch_Power (10 pins), Sch_Phy (15 pins), Sch_Buck (12 pins), Sch_Control (11 pins)
RETURN: Sch_Input (5 pins), Sch_Buck (C21.2 C22.2)
VBUS: Sch_Power (6 pins), Sch_Buck (6 pins)
ADC_VLEDN: Sch_Buck (R26.2 R28.1), Sch_Control (C4#2.1 J1#2.15 U1#2.7)
ADC_VLEDP: Sch_Buck (R25.2 R27.1), Sch_Control (C3#2.1 J1#2.16 U1#2.6)
APD+: Sch_Input (C8.1 J2.1), Sch_Power (D1.A R7.1)
CDB: Sch_Power (U2.6), Sch_Control (J1#2.12 U1#2.23)
CLK: Sch_Phy (U5.10 U5.14), Sch_Control (J1#2.5 PROG.4 U1#2.25)
DIM: Sch_Buck (R21.2), Sch_Control (J1#2.14 U1#2.9)
MDC: Sch_Phy (U5.22), Sch_Control (J1#2.9 U1#2.37)
MDIO: Sch_Phy (U5.23), Sch_Control (J1#2.10 U1#2.30)
PHY_RESET: Sch_Phy (U5.32), Sch_Control (C5#2.1 J1#2.1 U1#2.29)
PoE+: Sch_Input (C1#1.1 J1#1.7 J1#1.8), Sch_Power (DB1.4)
PoE-: Sch_Input (C2#1.1 J1#1.4 J1#1.5), Sch_Power (DB1.3)
RD_N: Sch_Input (T1.8 U1#1.4 U1#1.5), Sch_Phy (U5.26)
RD_P: Sch_Input (T1.6 U1#1.3 U1#1.6), Sch_Phy (U5.27)
RXCM: Sch_Input (C4#1.1 T1.10), Sch_Power (DB2.4)
RXD0: Sch_Phy (U5.18), Sch_Control (J1#2.7 U1#2.10)
RXD1: Sch_Phy (U5.17), Sch_Control (J1#2.6 U1#2.11)
RXDV: Sch_Phy (U5.19), Sch_Control (J1#2.8 U1#2.12)
SHDN: Sch_Buck (R23.2), Sch_Control (J1#2.13 U1#2.8)
T2P: Sch_Power (U2.7), Sch_Control (J1#2.11 U1#2.24)
TD_N: Sch_Input (T1.3 U1#1.2 U1#1.7), Sch_Phy (U5.29)
TD_P: Sch_Input (T1.1 U1#1.1 U1#1.8), Sch_Phy (U5.30)
TXCM: Sch_Input (C3#1.1 T1.15), Sch_Power (DB2.3)
TXD0: Sch_Phy (U5.9), Sch_Control (J1#2.4 U1#2.31)
TXD1: Sch_Phy (U5.8), Sch_Control (J1#2.3 U1#2.36)
TXEN: Sch_Phy (U5.5), Sch_Control (J1#2.2 U1#2.33)